# EAGLE design ScouseTom_New (EAGLE 7.2.0)

## Sheet 1 of 4
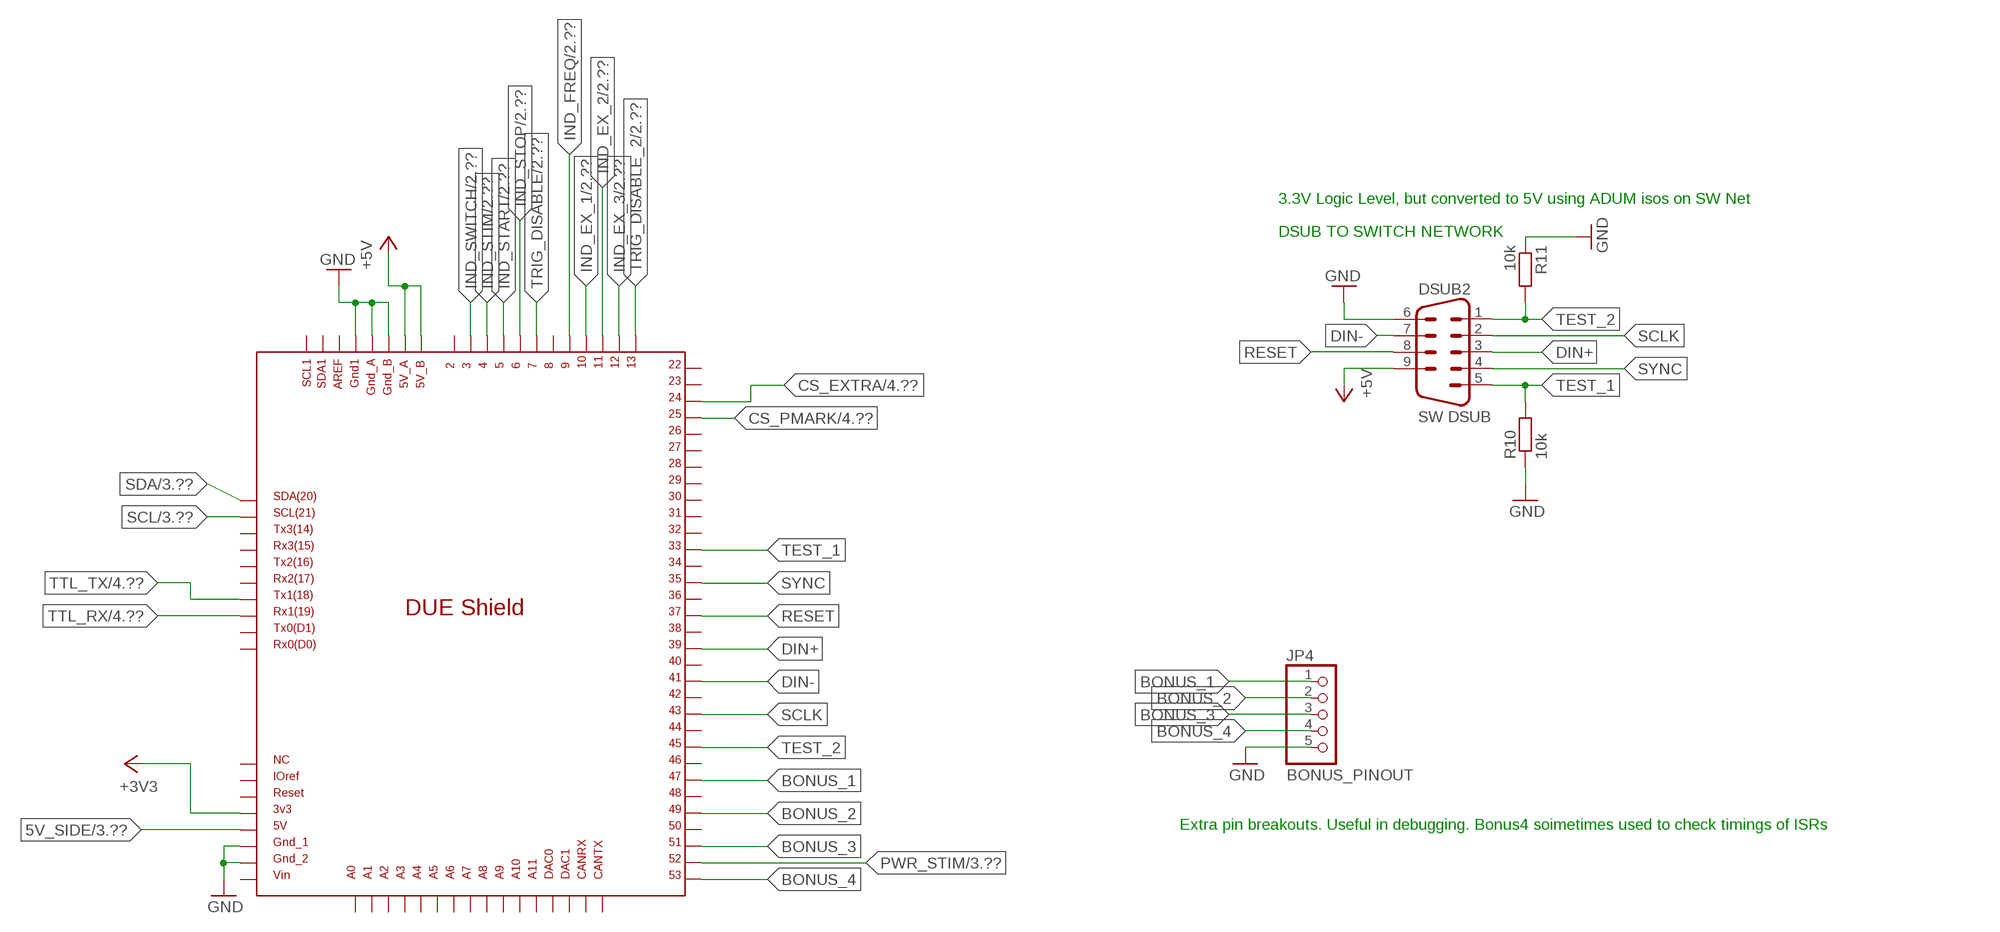
[diagram p0: schematic, sheet 1]

### Parts
ARD1  DUE(NOMID)  [DUE(NOMID)]
DSUB2  SW DSUB  DSUB9RA  [DSUB9]
JP4  BONUS_PINOUT  PINHD-1X5  [1X05]
R10  10k  R-EU_R0805  [R0805]
R11  10k  R-EU_R0805  [R0805]

### Nets
5V_SIDE: ARD1.5V ; also sheet 3
+3V3: ARD1.3V3 ; also sheet 3,4
+5V: ARD1.5V_A ARD1.5V_B DSUB2.9 ; also sheet 2
BONUS_1: ARD1.47 JP4.1
BONUS_2: ARD1.49 JP4.2
BONUS_3: ARD1.51 JP4.3
BONUS_4: ARD1.53 JP4.4
CS_EXTRA: ARD1.24 ; also sheet 4
CS_PMARK: ARD1.25 ; also sheet 4
DIN+: ARD1.39 DSUB2.3
DIN-: ARD1.41 DSUB2.7
GND: ARD1.GND1 ARD1.GND_1 ARD1.GND_2 ARD1.GND_A ARD1.GND_B DSUB2.6 JP4.5 R10.1 R11.1 ; also sheet 2,3,4
IND_EX_1: ARD1.10 ; also sheet 2
IND_EX_2: ARD1.11 ; also sheet 2
IND_EX_3: ARD1.12 ; also sheet 2
IND_FREQ: ARD1.9 ; also sheet 2
IND_START: ARD1.5 ; also sheet 2
IND_STIM: ARD1.4 ; also sheet 2,3
IND_STOP: ARD1.6 ; also sheet 2
IND_SWITCH: ARD1.3 ; also sheet 2
PWR_STIM: ARD1.52 ; also sheet 3
RESET: ARD1.37 DSUB2.8
SCL: ARD1.SCL ; also sheet 3
SCLK: ARD1.43 DSUB2.2
SDA: ARD1.SDA ; also sheet 3
SYNC: ARD1.35 DSUB2.4
TEST_1: ARD1.33 DSUB2.5 R10.2
TEST_2: ARD1.45 DSUB2.1 R11.2
TRIG_DISABLE: ARD1.7 ; also sheet 2
TRIG_DISABLE_2: ARD1.13 ; also sheet 2
TTL_RX: ARD1.RX1 ; also sheet 4
TTL_TX: ARD1.TX1 ; also sheet 4
Unconnected: ARD1.2 ARD1.8 ARD1.22 ARD1.23 ARD1.26 ARD1.27 ARD1.28 ARD1.29 ARD1.30 ARD1.31 ARD1.32 ARD1.34 ARD1.36 ARD1.38 ARD1.40 ARD1.42 ARD1.44 ARD1.46 ARD1.48 ARD1.50 ARD1.A0 ARD1.A1 ARD1.A2 ARD1.A3 ARD1.A4 ARD1.A5 ARD1.A6 ARD1.A7 ARD1.A8 ARD1.A9 ARD1.A10 ARD1.A11 ARD1.AREF ARD1.CANRX ARD1.CANTX ARD1.DAC0 ARD1.DAC1 ARD1.IOREF ARD1.NC ARD1.RESET ARD1.RX0 ARD1.RX2 ARD1.RX3 ARD1.SCL1 ARD1.SDA1 ARD1.TX0 ARD1.TX2 ARD1.TX3 ARD1.VIN

### Notes on the sheet
- 3.3V Logic Level, but converted to 5V using ADUM isos on SW Net
- DSUB TO SWITCH NETWORK
- Extra pin breakouts. Useful in debugging. Bonus4 soimetimes used to check timings of ISRs

## Sheet 2 of 4: Indicator_Isolation
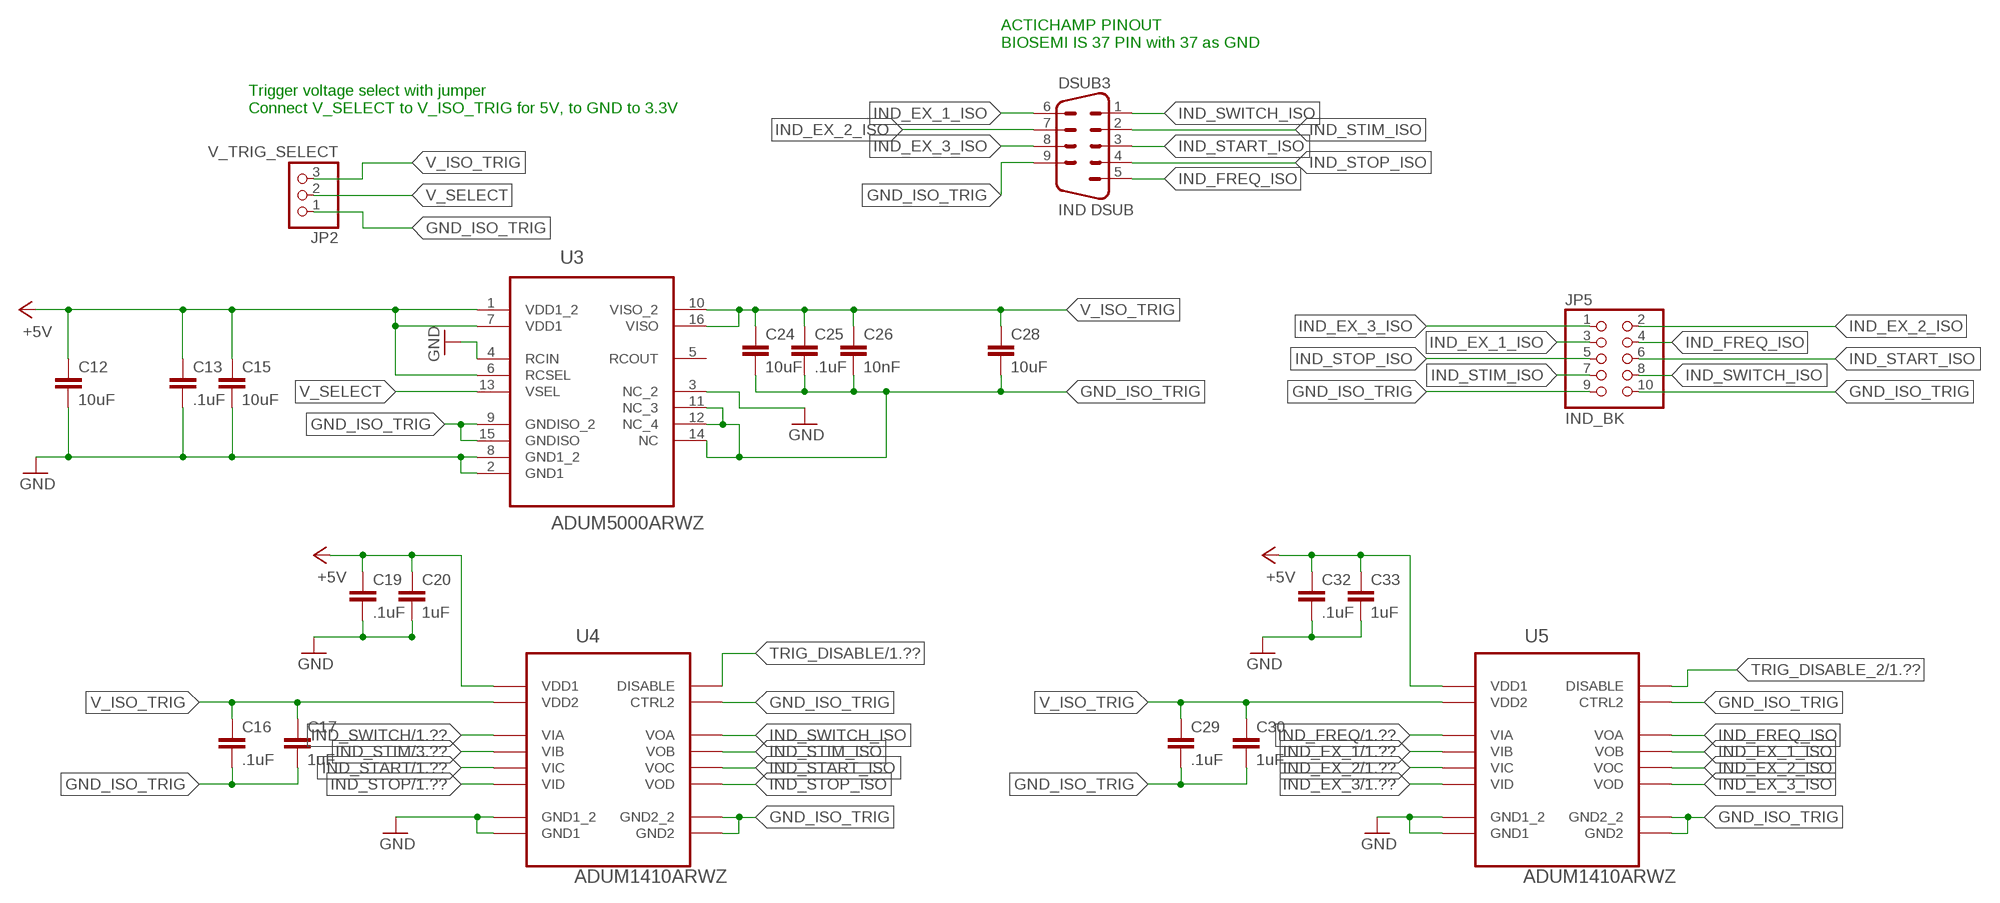
[diagram p1: schematic, sheet 2]

### Parts
C12  10uF  C-EUC0805  [C0805]
C13  .1uF  C-EUC0805  [C0805]
C15  10uF  C-EUC0805  [C0805]
C16  .1uF  C-EUC0805  [C0805]
C17  1uF  C-EUC0805  [C0805]
C19  .1uF  C-EUC0805  [C0805]
C20  1uF  C-EUC0805  [C0805]
C24  10uF  C-EUC0805  [C0805]
C25  .1uF  C-EUC0805  [C0805]
C26  10nF  C-EUC0805  [C0805]
C28  10uF  C-EUC0805  [C0805]
C29  .1uF  C-EUC0805  [C0805]
C30  1uF  C-EUC0805  [C0805]
C32  .1uF  C-EUC0805  [C0805]
C33  1uF  C-EUC0805  [C0805]
DSUB3  IND DSUB  DSUB9RA  [DSUB9]
JP2  V_TRIG_SELECT  PINHD-1X3  [1X03]
JP5  IND_BK  PINHD-2X5  [2X05]
U3  ADUM5000ARWZ  [SOIC127P1032X265-16N]
U4  ADUM1410ARWZ  [SOIC127P1032X265-16N]
U5  ADUM1410ARWZ  [SOIC127P1032X265-16N]

### Nets
+5V: C12.1 C13.1 C15.1 C19.1 C20.1 C32.1 C33.1 U3.1(VDD1_2) U3.6(RCSEL) U3.7(VDD1) U4.1(VDD1) U5.1(VDD1) ; also sheet 1
GND: C12.2 C13.2 C15.2 C19.2 C20.2 C32.2 C33.2 U3.2(GND1) U3.3(NC_2) U3.4(RCIN) U3.8(GND1_2) U4.2(GND1_2) U4.8(GND1) U5.2(GND1_2) U5.8(GND1) ; also sheet 1,3,4
GND_ISO_TRIG: C16.2 C17.2 C24.2 C25.2 C26.2 C28.2 C29.2 C30.2 DSUB3.9 JP2.1 JP5.9 JP5.10 U3.9(GNDISO_2) U3.11(NC_3) U3.12(NC_4) U3.14(NC) U3.15(GNDISO) U4.9(GND2_2) U4.10(CTRL2) U4.15(GND2) U5.9(GND2_2) U5.10(CTRL2) U5.15(GND2)
IND_EX_1: U5.4(VIB) ; also sheet 1
IND_EX_1_ISO: DSUB3.6 JP5.3 U5.13(VOB)
IND_EX_2: U5.5(VIC) ; also sheet 1
IND_EX_2_ISO: DSUB3.7 JP5.2 U5.12(VOC)
IND_EX_3: U5.6(VID) ; also sheet 1
IND_EX_3_ISO: DSUB3.8 JP5.1 U5.11(VOD)
IND_FREQ: U5.3(VIA) ; also sheet 1
IND_FREQ_ISO: DSUB3.5 JP5.4 U5.14(VOA)
IND_START: U4.5(VIC) ; also sheet 1
IND_START_ISO: DSUB3.3 JP5.6 U4.12(VOC)
IND_STIM: U4.4(VIB) ; also sheet 1,3
IND_STIM_ISO: DSUB3.2 JP5.7 U4.13(VOB)
IND_STOP: U4.6(VID) ; also sheet 1
IND_STOP_ISO: DSUB3.4 JP5.5 U4.11(VOD)
IND_SWITCH: U4.3(VIA) ; also sheet 1
IND_SWITCH_ISO: DSUB3.1 JP5.8 U4.14(VOA)
TRIG_DISABLE: U4.7(DISABLE) ; also sheet 1
TRIG_DISABLE_2: U5.7(DISABLE) ; also sheet 1
V_ISO_TRIG: C16.1 C17.1 C24.1 C25.1 C26.1 C28.1 C29.1 C30.1 JP2.3 U3.10(VISO_2) U3.16(VISO) U4.16(VDD2) U5.16(VDD2)
V_SELECT: JP2.2 U3.13(VSEL)
Unconnected: U3.5(RCOUT)

### Notes on the sheet
- ACTICHAMP PINOUT
  BIOSEMI IS 37 PIN with 37 as GND
- Trigger voltage select with jumper
  Connect V_SELECT to V_ISO_TRIG for 5V, to GND to 3.3V

## Sheet 3 of 4: Stimulator_PGA
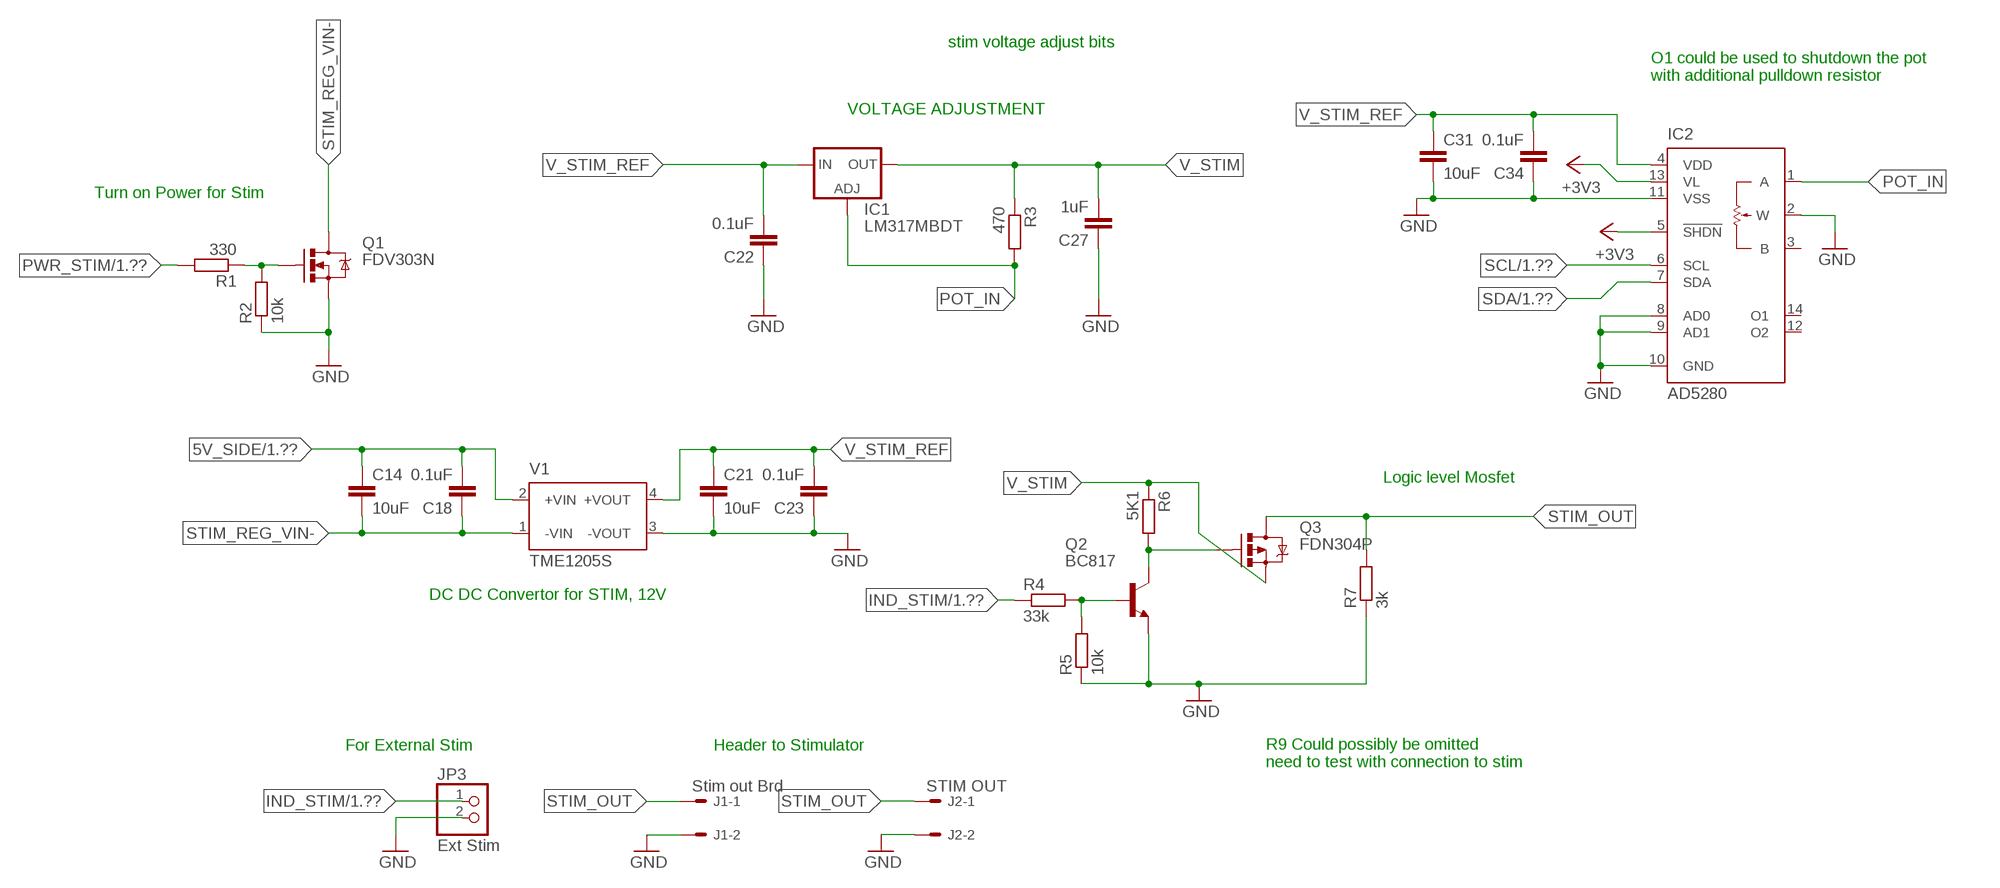
[diagram p2: schematic, sheet 3]

### Parts
C14  10uF  C-EUC0805  [C0805]
C18  0.1uF  C-EUC0805  [C0805]
C21  10uF  C-EUC0805  [C0805]
C22  0.1uF  C-EUC0805  [C0805]
C23  0.1uF  C-EUC0805  [C0805]
C27  1uF  C-EUC0805  [C0805]
C31  10uF  C-EUC0805  [C0805]
C34  0.1uF  C-EUC0805  [C0805]
IC1  LM317MBDT  [DPACK]
IC2  AD5280  [TSSOP14]
J1  Stim out Brd  22-27-2021-02  [6410-02]
J2  STIM OUT  22-05-7028-02  [7395-02]
JP3  Ext Stim  PINHD-1X2  [1X02]
Q1  FDV303N  MOSFET-NCHANNEL2N7002PW  [SOT323]
Q2  BC817  BC817-40SMD  [SOT23-BEC]
Q3  FDN304P  MOSFET-PCHANNEL  [SOT23-3]
R1  330  R-EU_R0805  [R0805]
R2  10k  R-EU_R0805  [R0805]
R3  470  R-EU_R0805  [R0805]
R4  33k  R-EU_R0805  [R0805]
R5  10k  R-EU_R0805  [R0805]
R6  5K1  R-EU_R0805  [R0805]
R7  3k  R-EU_R0805  [R0805]
V1  TME1205S  [TME]

### Nets
5V_SIDE: C14.1 C18.2 V1.2(+VIN) ; also sheet 1
+3V3: IC2.5(!SHDN) IC2.13(VL) ; also sheet 1,4
GND: C21.2 C22.1 C23.1 C27.1 C31.2 C34.1 IC2.2(W) IC2.8(AD0) IC2.9(AD1) IC2.10(GND) IC2.11(VSS) J1.2 J2.2 JP3.2 Q1.2(S) Q2.E R2.1 R5.1 R7.1 V1.3(-VOUT) ; also sheet 1,2,4
IND_STIM: JP3.1 R4.1 ; also sheet 1,2
N$1: Q2.B R4.2 R5.2
N$3: Q2.C Q3.1(G) R6.2
N$5: Q1.1(G) R1.1 R2.2
POT_IN: IC1.1(ADJ) IC2.1(A) R3.2
PWR_STIM: R1.2 ; also sheet 1
SCL: IC2.6(SCL) ; also sheet 1
SDA: IC2.7(SDA) ; also sheet 1
STIM_OUT: J1.1 J2.1 Q3.3(D) R7.2
STIM_REG_VIN-: C14.2 C18.1 Q1.3(D) V1.1(-VIN)
V_STIM: C27.2 IC1.4(OUT) Q3.2(S) R3.1 R6.1
V_STIM_REF: C21.1 C22.2 C23.2 C31.1 C34.2 IC1.3(IN) IC2.4(VDD) V1.4(+VOUT)
Unconnected: IC2.3(B) IC2.12(O2) IC2.14(O1)

### Notes on the sheet
- stim voltage adjust bits
- O1 could be used to shutdown the pot
  with additional pulldown resistor
- VOLTAGE ADJUSTMENT
- Turn on Power for Stim
- Logic level Mosfet
- DC DC Convertor for STIM, 12V
- For External Stim | Header to Stimulator
- R9 Could possibly be omitted
  need to test with connection to stim

## Sheet 4 of 4: Current_Source_Comm_Isolation
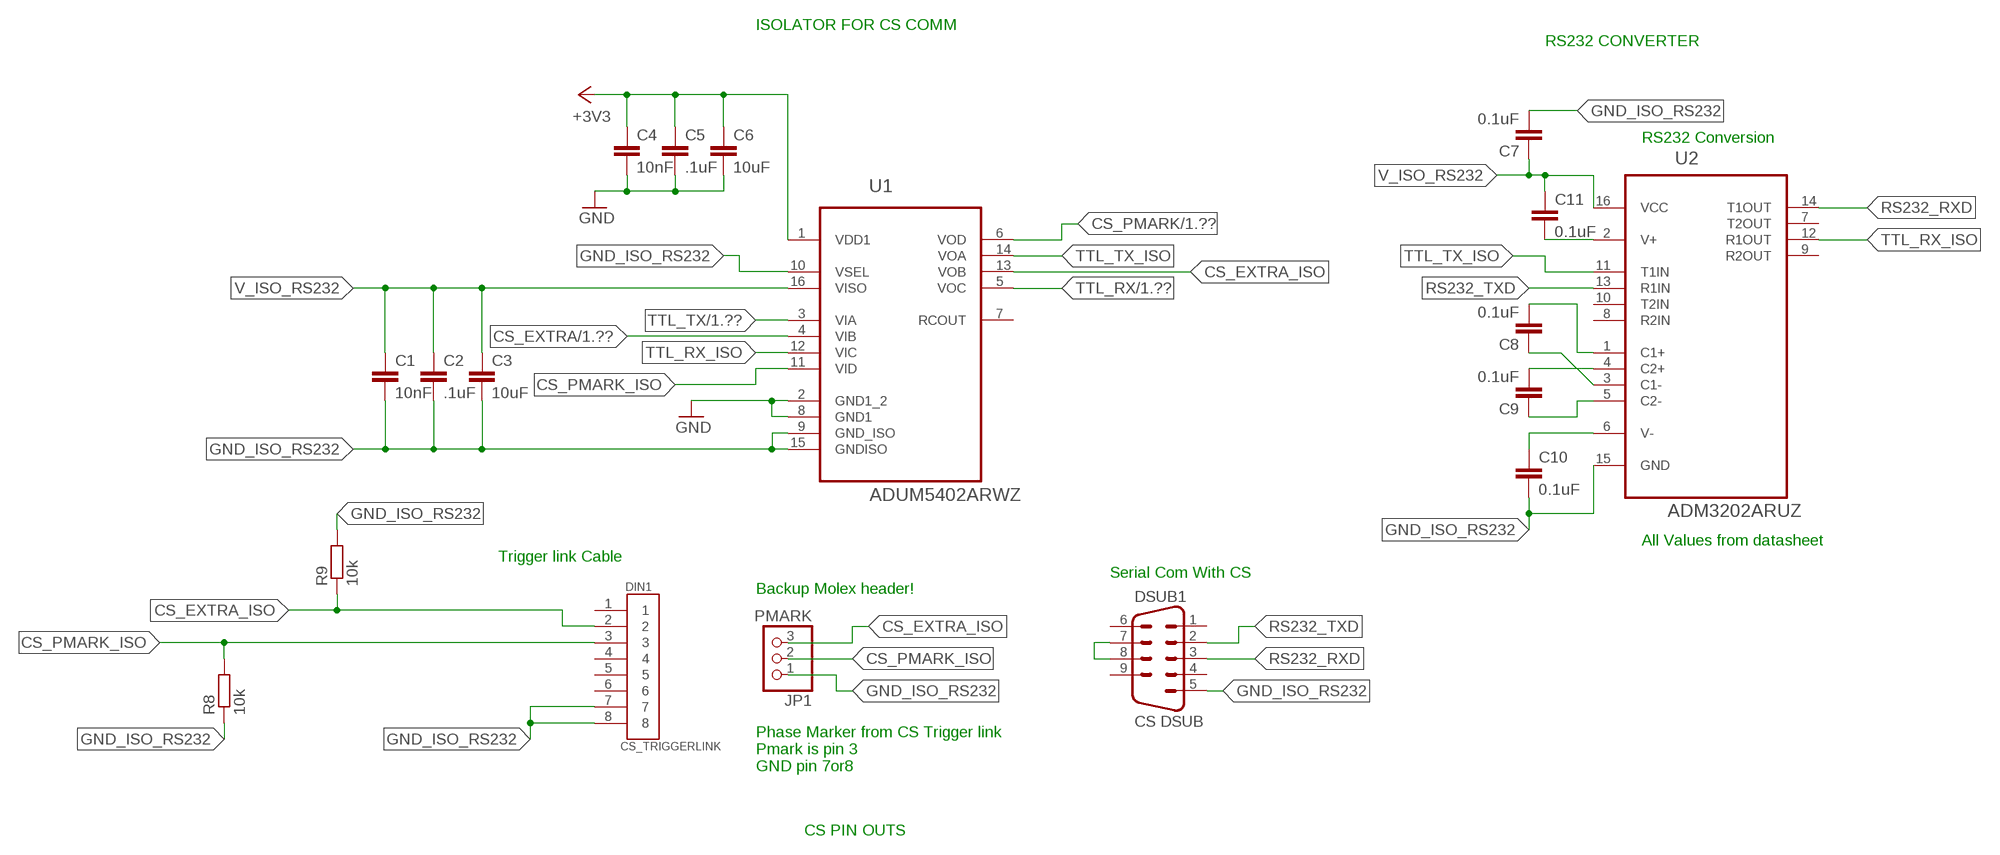
[diagram p3: schematic, sheet 4]

### Parts
C1  10nF  C-EUC0805  [C0805]
C2  .1uF  C-EUC0805  [C0805]
C3  10uF  C-EUC0805  [C0805]
C4  10nF  C-EUC0805  [C0805]
C5  .1uF  C-EUC0805  [C0805]
C6  10uF  C-EUC0805  [C0805]
C7  0.1uF  C-EUC0805  [C0805]
C8  0.1uF  C-EUC0805  [C0805]
C9  0.1uF  C-EUC0805  [C0805]
C10  0.1uF  C-EUC0805  [C0805]
C11  0.1uF  C-EUC0805  [C0805]
DIN1  CS_TRIGGERLINK  DIN8  [DIN8]
DSUB1  CS DSUB  DSUB9RA  [DSUB9]
JP1  PMARK  PINHD-1X3  [1X03]
R8  10k  R-EU_R0805  [R0805]
R9  10k  R-EU_R0805  [R0805]
U1  ADUM5402ARWZ  [SOIC127P1032X265-16N]
U2  ADM3202ARUZ  [SOP65P640X120-16N]

### Nets
+3V3: C4.1 C5.1 C6.1 U1.1(VDD1) ; also sheet 1,3
CS_EXTRA: U1.4(VIB) ; also sheet 1
CS_EXTRA_ISO: DIN1.2 JP1.3 R9.1 U1.13(VOB)
CS_PMARK: U1.6(VOD) ; also sheet 1
CS_PMARK_ISO: DIN1.3 JP1.2 R8.2 U1.11(VID)
GND: C4.2 C5.2 C6.2 U1.2(GND1_2) U1.8(GND1) ; also sheet 1,2,3
GND_ISO_RS232: C1.2 C2.2 C3.2 C7.2 C10.2 DIN1.7 DIN1.8 DSUB1.5 JP1.1 R8.1 R9.2 U1.9(GND_ISO) U1.10(VSEL) U1.15(GNDISO) U2.15(GND)
N$4: DSUB1.7 DSUB1.8
N$22: C8.2 U2.1(C1+)
N$23: C8.1 U2.3(C1-)
N$24: C9.2 U2.4(C2+)
N$25: C9.1 U2.5(C2-)
N$26: C11.2 U2.2(V+)
N$27: C10.1 U2.6(V-)
RS232_RXD: DSUB1.3 U2.14(T1OUT)
RS232_TXD: DSUB1.2 U2.13(R1IN)
TTL_RX: U1.5(VOC) ; also sheet 1
TTL_RX_ISO: U1.12(VIC) U2.12(R1OUT)
TTL_TX: U1.3(VIA) ; also sheet 1
TTL_TX_ISO: U1.14(VOA) U2.11(T1IN)
V_ISO_RS232: C1.1 C2.1 C3.1 C7.1 C11.1 U1.16(VISO) U2.16(VCC)
Unconnected: DIN1.1 DIN1.4 DIN1.5 DIN1.6 DSUB1.1 DSUB1.4 DSUB1.6 DSUB1.9 U1.7(RCOUT) U2.7(T2OUT) U2.8(R2IN) U2.9(R2OUT) U2.10(T2IN)

### Notes on the sheet
- ISOLATOR FOR CS COMM
- RS232 CONVERTER
- RS232 Conversion
- All Values from datasheet
- Trigger link Cable
- Serial Com With CS
- Backup Molex header!
- Phase Marker from CS Trigger link
  Pmark is pin 3
  GND pin 7or8
- CS PIN OUTS

## Library data of the parts
ARD1 = DUElib130425_JAMES:DUE(NOMID)
C1-C34 = resistor:C-EU: CAPACITOR, European symbol
DIN1 = mini din 8 james:DIN8
DSUB1-DSUB3 = DSUBJAMES:DSUB9RA
IC1 = v-reg:LM317?*: 500 mA Adjustable Output Positive Voltage Regulator Source: http://www.onsemi.co.jp .. LM317M-D.PDF
IC2 = analog-devices:AD5280: Single +15 V/±5 V, 256-Position, I2C-Compatible Digital Potentiometer Source: http://www.analog.com/static/imported-files/data_sheets/AD5280_5282.pdf; MF: ALTERA CORPORATION; MPN: AD5280BRUZ20; OC_FARNELL: 1464325; OC_NEWARK: 59K3840
J1 = con-molex:22-?-02: CONNECTOR wire to board 2.54 mm (.1 inch) pitch header; OC_FARNELL: unknown; OC_NEWARK: unknown
J2 = con-molex:22-?-02: CONNECTOR wire to board 2.54 mm (.1 inch) pitch header; OC_FARNELL: 9731601; OC_NEWARK: unknown
JP1 JP2 = pinhead:PINHD-1X3: PIN HEADER
JP3 = pinhead:PINHD-1X2: PIN HEADER
JP4 = pinhead:PINHD-1X5: PIN HEADER
JP5 = pinhead:PINHD-2X5: PIN HEADER
Q1 = SparkFun-DiscreteSemi:MOSFET-NCHANNEL: Common NMOSFET Parts MFG P/N Store ID Prod ID FDD8780 TRANS-09984 SI7820DN TRANS-11055 FDS6630A IC-08089 2N7002PW TRANS-11151 FQP30N06L COM-10213 TRANS-10060 BSS123LT1G TRANS-08345 BSS138 TRANS-00830 BS170 2N7000; PROD_ID: TRANS-11151
Q2 = transistor-npn:BC817*: NPN Transistor
Q3 = SparkFun-DiscreteSemi:MOSFET-PCHANNEL: Generic PMOSFET IRLML2244 - TRANS-11153 (SOT-23 -20V -4.3A) (1.Gate 2.Source 3.Drain) FQP27P06 - COM-10349 <http://www.sparkfun.com/products/10349> (TO-220 -60V -27A) (1.Gate 2.Source 3.Drain); PROD_ID: TRANS-08285
R1-R11 = resistor:R-EU_: RESISTOR, European symbol
U1 = Analog Devices_By_element14_Batch_1:ADUM5402ARWZ: Quad-Channel Isolators with Integrated DC-to-DC Converter; MPN: ADUM5402ARWZ; OC_FARNELL: 1838922; OC_NEWARK: 11N8824; PACKAGE: SOIC-16; SUPPLIER: Analog Devices
U2 = Analog Devices_By_element14_Batch_1:ADM3202ARUZ: Low Power, 3.3 V, RS-232 Line Drivers/Receivers; MPN: ADM3202ARUZ; OC_FARNELL: 9425586; OC_NEWARK: 59K2064; PACKAGE: TSSOP-16; SUPPLIER: Analog Devices
U3 = Analog Devices_By_element14_Batch_1:ADUM5000ARWZ: 2.5 kV, Isolated DC-to-DC Converter; MPN: ADUM5000ARWZ; OC_FARNELL: 1701256; OC_NEWARK: 19P8235; PACKAGE: SOIC-16; SUPPLIER: Analog Devices
U4 U5 = ADI-Phase-2:ADUM1410ARWZ: ISOLATOR, DGTL, 4CHAN; MPN: ADUM1410ARWZ; OC_FARNELL: 2067770; OC_NEWARK: 73T8174; PACKAGE: 16-Lead SOIC_W; SUPPLIER: Analog Devices
V1 = traco-electronic:TME?*: DC/DC Converter TME Series 1 Watt Source: www.tracopower.com .. tme.pdf; MPN: TME 1205S; OC_FARNELL: 1007542; OC_NEWARK: 51R5325

## Net classes
1 power: width 0.61 mm, drill 0.61 mm, clearance 0.254 mm
2 gnd: width 0.305 mm, drill 0.559 mm, clearance 0.254 mm
3 usbvcc: width 0.508 mm, drill 0.61 mm, clearance 0.254 mm
4 aref: width 0.406 mm, drill 0.61 mm, clearance 0.254 mm

## Board
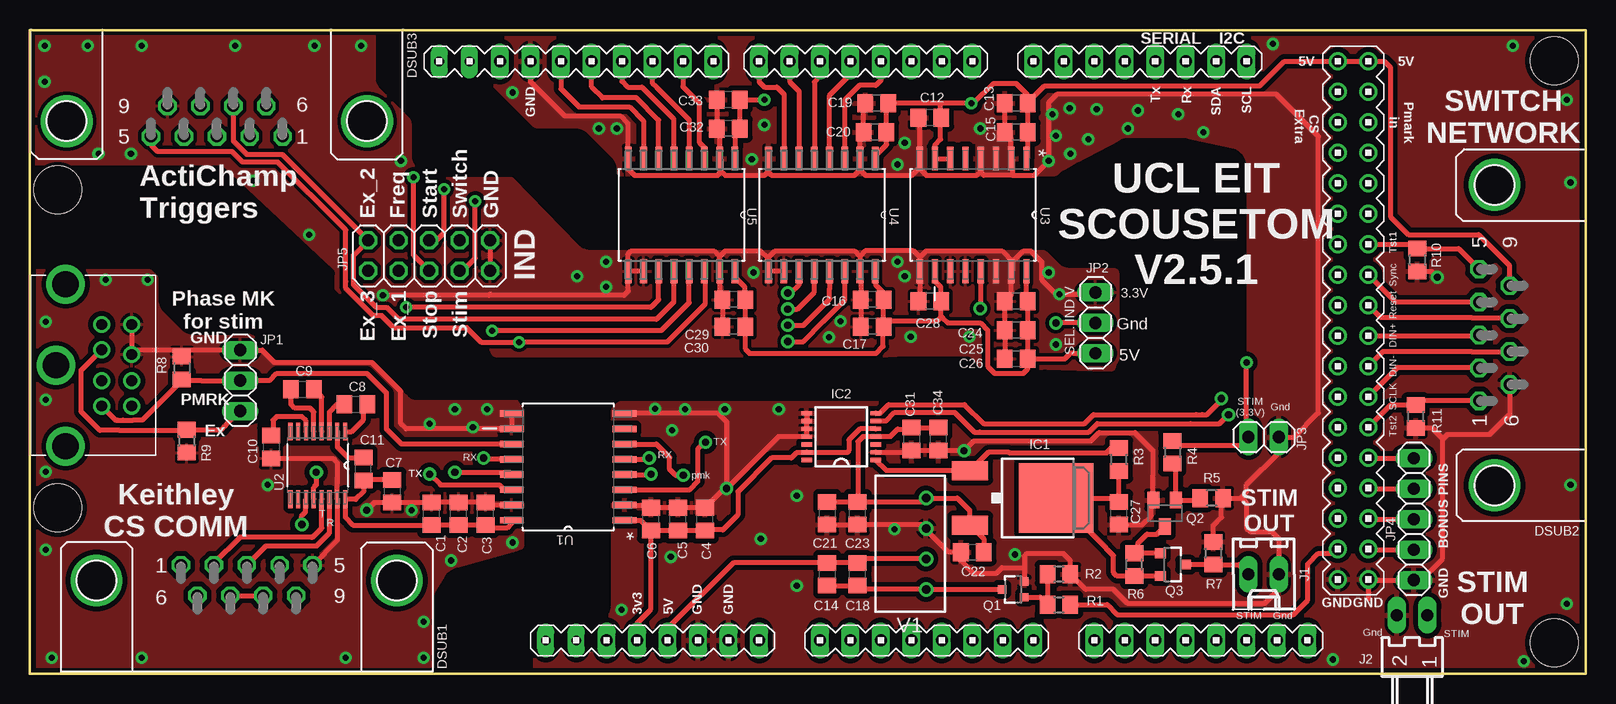
[diagram p4: board, top side]
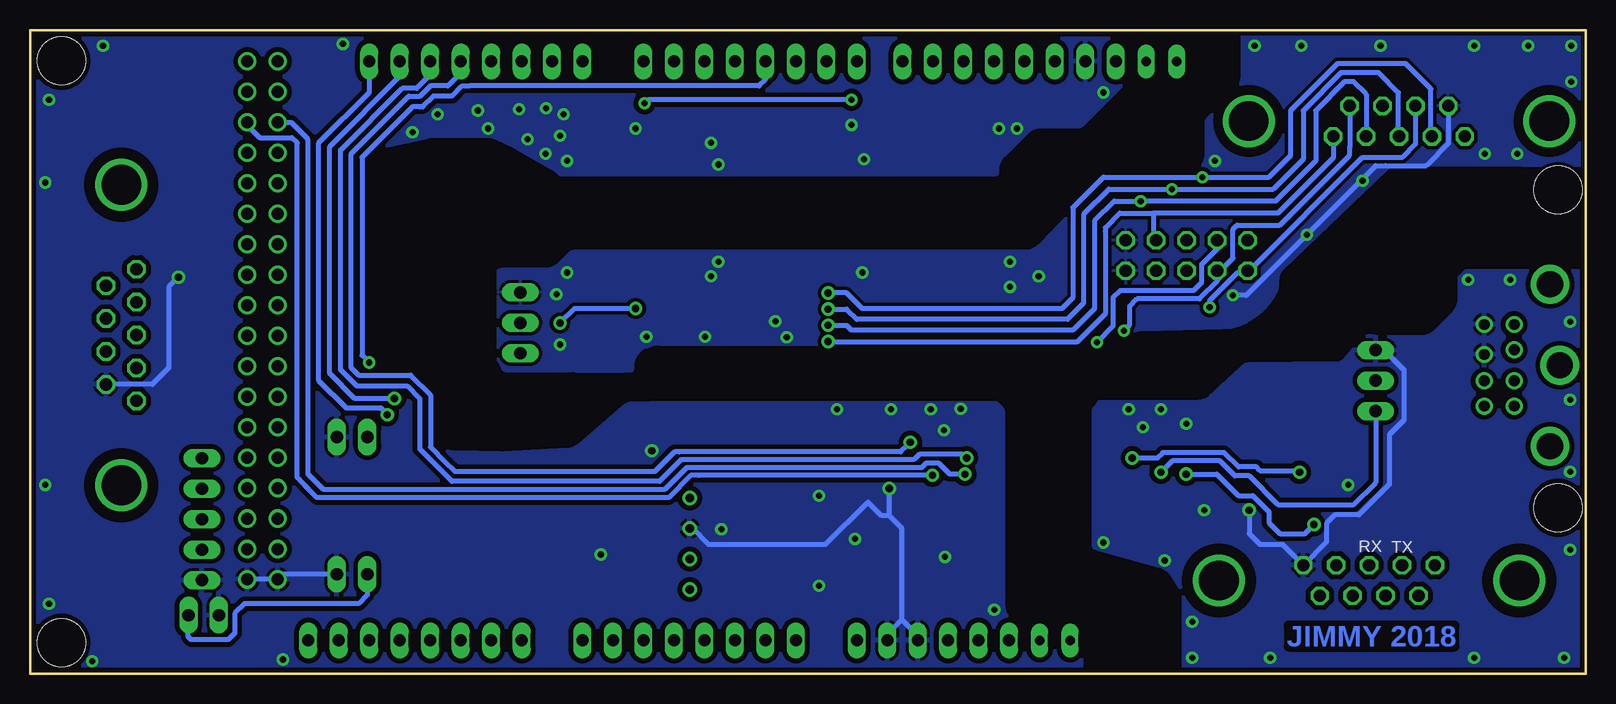
[diagram p5: board, bottom side, seen from below]

Size 129.69 x 53.67 mm. Coordinates in mm from the lower left corner, seen from the top.
Outline: 129.69,53.67 0,53.67 0,0 129.69,0 129.69,53.67
Copper layers (1*16): Top 0.035mm / dielectric 1.5mm / Bottom 0.035mm
Design rules "pcbtrain": minimum track width 0.2mm, minimum drill 0.4mm, track to track 0.2mm, track to pad 0.2mm, pad to pad 0.2mm, via to via 0.2mm, smd to smd 0mil, copper to edge 10mil, drill to drill 0.2mm, minimum pad ring 10mil, minimum via ring 10mil, stop-mask expansion 0.125mm, vias tented up to drill 0mil, thermal gap 10mil
Holes 4 mm at 127.06,51.11 127.06,2.61 2.31,13.86 2.31,40.36
tRestrict: area -5.2,-2.6 to 100.8,56.4
bRestrict: area -5.2,-2.6 to 100.8,56.4

### Footprints (pad centres in the part's own frame; a part is rotated, then mirrored left to right if it is on the bottom)
DUE(NOMID) = drill 1 long: 2 -5.08,25.4; 3 -7.62,25.4; 3V3 -27.94,-22.86; 4 -10.16,25.4; 5 -12.7,25.4; 5V -25.4,-22.86; 6 -15.24,25.4; 7 -17.78,25.4; 8 -21.59,25.4; 9 -24.13,25.4; 10 -26.67,25.4; 11 -29.21,25.4; 12 -31.75,25.4; 13 -34.29,25.4; A0 -12.7,-22.86; A1 -10.16,-22.86; A2 -7.62,-22.86; A3 -5.08,-22.86; A4 -2.54,-22.86; A5 0,-22.86; A6 2.54,-22.86; A7 5.08,-22.86; A8 10.16,-22.86; A9 12.7,-22.86; A10 15.24,-22.86; A11 17.78,-22.86; AREF -39.37,25.4; CANRX 25.4,-22.86; CANTX 27.94,-22.86; DAC0 20.32,-22.86; DAC1 22.86,-22.86; GND1 -36.83,25.4; GND_1 -22.86,-22.86; GND_2 -20.32,-22.86; RESET -30.48,-22.86; RX0 0,25.4; RX1 17.78,25.4; RX2 12.7,25.4; RX3 7.62,25.4; SCL 22.86,25.4; SDA 20.32,25.4; TX0 -2.54,25.4; TX1 15.24,25.4; TX2 10.16,25.4; TX3 5.08,25.4; VIN -17.78,-22.86 | drill 1: 5V_A 30.48,25.4; 5V_B 33.02,25.4; 22 30.48,22.86; 23 33.02,22.86; 24 30.48,20.32; 25 33.02,20.32; 26 30.48,17.78; 27 33.02,17.78; 28 30.48,15.24; 29 33.02,15.24; 30 30.48,12.7; 31 33.02,12.7; 32 30.48,10.16; 33 33.02,10.16; 34 30.48,7.62; 35 33.02,7.62; 36 30.48,5.08; 37 33.02,5.08; 38 30.48,2.54; 39 33.02,2.54; 40 30.48,0; 41 33.02,0; 42 30.48,-2.54; 43 33.02,-2.54; 44 30.48,-5.08; 45 33.02,-5.08; 46 30.48,-7.62; 47 33.02,-7.62; 48 30.48,-10.16; 49 33.02,-10.16; 50 30.48,-12.7; 51 33.02,-12.7; 52 30.48,-15.24; 53 33.02,-15.24; GND_A 30.48,-17.78; GND_B 33.02,-17.78 | drill 0.8 pad 1.422 long: IOREF -33.02,-22.86; NC -35.56,-22.86; SCL1 -44.45,25.4; SDA1 -41.91,25.4
C0805 = smd 1.3 x 1.5: 1 -0.95,0; 2 0.95,0
DIN8 = drill 0.9: 1 -1.3,-3.8; 2 1.3,-3.8; 3 -3.4,-3.8; 4 -1.3,-6.3; 5 3.4,-3.8; 6 -3.4,-6.3; 7 0.9,-6.3; 8 3.4,-6.3 | drill 2.2: P$1 0,0; P$2 -6.75,-0.8; P$3 6.75,-0.8
DSUB9 = drill 1.016 octagon: 1 -5.486,0; 2 -2.743,0; 3 0,0; 4 2.743,0; 5 5.486,0; 6 -4.115,-2.54; 7 -1.372,-2.54; 8 1.372,-2.54; 9 4.115,-2.54 | drill 3.302: 10 -12.522,-1.27; 11 12.522,-1.27
DPACK = smd 1.6 x 3: 1 -2.28,-4.8; 3 2.28,-4.8 | smd 5.8 x 6.2: 4 0,2.38
TSSOP14 = smd 0.9 x 0.35: 1 -2.875,1.95; 2 -2.875,1.3; 3 -2.875,0.65; 4 -2.875,0; 5 -2.875,-0.65; 6 -2.875,-1.3; 7 -2.875,-1.95; 8 2.875,-1.95; 9 2.875,-1.3; 10 2.875,-0.65; 11 2.875,0; 12 2.875,0.65; 13 2.875,1.3; 14 2.875,1.95
6410-02 = drill 1.016 long: 1 1.27,0; 2 -1.27,0
7395-02 = drill 1.016 long: 1 1.27,0; 2 -1.27,0
1X03 = drill 1.016 long: 1 -2.54,0; 2 0,0; 3 2.54,0
1X02 = drill 1.016 long: 1 -1.27,0; 2 1.27,0
1X05 = drill 1.016 long: 1 -5.08,0; 2 -2.54,0; 3 0,0; 4 2.54,0; 5 5.08,0
2X05 = drill 1.016 octagon: 1 -5.08,-1.27; 2 -5.08,1.27; 3 -2.54,-1.27; 4 -2.54,1.27; 5 0,-1.27; 6 0,1.27; 7 2.54,-1.27; 8 2.54,1.27; 9 5.08,-1.27; 10 5.08,1.27
SOT323 = smd 0.7 x 0.7: 1 -0.65,-0.925; 2 0.65,-0.925; 3 0,0.925
SOT23-BEC = smd 1 x 1.4: B -0.95,-1.1; C 0,1.1; E 0.95,-1.1
SOT23-3 = smd 0.8 x 0.9: 1 -0.95,-1; 2 0.95,-1; 3 0,1.1
R0805 = smd 1.3 x 1.5: 1 -0.95,0; 2 0.95,0
SOIC127P1032X265-16N = smd 1.981 x 0.533: 1 -4.699,4.445; 2 -4.699,3.175; 3 -4.699,1.905; 4 -4.699,0.635; 5 -4.699,-0.635; 6 -4.699,-1.905; 7 -4.699,-3.175; 8 -4.699,-4.445; 9 4.699,-4.445; 10 4.699,-3.175; 11 4.699,-1.905; 12 4.699,-0.635; 13 4.699,0.635; 14 4.699,1.905; 15 4.699,3.175; 16 4.699,4.445
SOP65P640X120-16N = smd 1.473 x 0.356: 1 -2.819,2.286; 2 -2.819,1.626; 3 -2.819,0.965; 4 -2.819,0.33; 5 -2.819,-0.33; 6 -2.819,-0.965; 7 -2.819,-1.626; 8 -2.819,-2.286; 9 2.819,-2.286; 10 2.819,-1.626; 11 2.819,-0.965; 12 2.819,-0.33; 13 2.819,0.33; 14 2.819,0.965; 15 2.819,1.626; 16 2.819,2.286
SOIC127P1032X265-16N' = smd 1.981 x 0.559: 1 -4.699,4.445; 2 -4.699,3.175; 3 -4.699,1.905; 4 -4.699,0.635; 5 -4.699,-0.635; 6 -4.699,-1.905; 7 -4.699,-3.175; 8 -4.699,-4.445; 9 4.699,-4.445; 10 4.699,-3.175; 11 4.699,-1.905; 12 4.699,-0.635; 13 4.699,0.635; 14 4.699,1.905; 15 4.699,3.175; 16 4.699,4.445
TME = drill 0.7 pad 1.1: 1 -3.81,0; 2 -1.27,0; 3 1.27,0; 4 3.81,0

### Placement (x,y rotation side)
ARD1  78.56,25.65 0 top
C1  33.46,13.36 90 top
C2  35.71,13.36 90 top
C3  37.96,13.36 90 top
C4  56.27,12.91 90 top
C5  54.02,12.91 90 top
C6  51.77,12.91 90 top
C7  30.2,15.23 270 top
C8  27.16,22.46 0 top
C9  22.71,23.74 0 top
C10  20.09,18.91 270 top
C11  27.8,17.09 90 top
C12  75.02,46.36 180 top
C13  82.22,47.56 180 top
C14  66.44,8.32 270 top
C15  82.22,45.16 180 top
C16  70.22,31.21 180 top
C17  70.22,28.96 180 top
C18  68.98,8.32 90 top
C19  70.59,47.56 180 top
C20  70.44,45.16 180 top
C21  66.44,13.39 270 top
C22  78.55,10.16 0 top
C23  68.98,13.39 90 top
C24  82.22,31.06 180 top
C25  82.22,28.65 180 top
C26  82.22,26.25 180 top
C27  90.78,13.39 90 top
C28  75.02,31.06 180 top
C29  58.66,31.21 180 top
C30  58.66,28.96 180 top
C31  73.48,19.58 270 top
C32  58.21,45.45 180 top
C33  58.21,47.86 180 top
C34  75.72,19.58 90 top
DIN1  2.17,25.72 90 top
DSUB1  18.06,9.07 0 top
DSUB2  120.81,28.25 90 top
DSUB3  15.57,44.8 180 top
IC1  83.16,14.66 270 top
IC2  67.62,19.78 180 top
J1  102.84,8.32 180 top
J2  115.22,4.91 0 top
JP1  17.52,24.46 270 top
JP2  88.81,29.25 270 top
JP3  102.84,19.75 0 top
JP4  115.36,12.91 270 top
JP5  33.27,34.87 0 top
Q1  81.96,7.05 90 top
Q2  94.59,13.39 180 top
Q3  95.22,9.12 270 top
R1  85.77,5.78 0 top
R2  85.77,8.32 180 top
R3  90.78,17.88 90 top
R4  95.22,18.47 270 top
R5  98.5,14.66 180 top
R6  92.05,9.12 90 top
R7  98.63,10.07 270 top
R8  12.66,25.5 270 top
R9  13.06,19.4 270 top
R10  115.66,34.5 90 top
R11  115.52,21.46 90 top
U1  44.87,17.25 180 top
U2  23.98,17.39 270 top
U3  78.61,38.25 270 top
U4  ADUM1410ARWZ  [SOIC127P1032X265-16N']  66.02,38.25 270 top
U5  ADUM1410ARWZ  [SOIC127P1032X265-16N']  54.31,38.25 270 top
V1  74.7,10.86 90 top

### Tracks (layer width: path | path; a pad name or v marks a point on that pad's centre or on a via)
5V_SIDE
  Top 0.406: V1.2 69.3,9.59 C18.2 C14.1 58.62,9.27 53.16,3.8 ARD1.5V
+3V3
  Top 0.406: C6.1 C5.1 C4.1 56.27,12 57.77,12 59.02,13.25 59.02,15.21 61.81,18 63.46,18 63.91,18.46 64.72,18.46 IC2.13 64.77,18.46 68.11,18.46 68.27,18.61 68.27,19.5 69.19,20.43 IC2.5 | C6.1 51.77,5.39 50.61,4.25 ARD1.3V3 | U1.1 50.91,12.81 C6.1
+5V  (via drill 0.51)
  Top 0.406: C13.1 C15.1 83.16,43.06 U3.1 | U4.1 70.56,43.06 70.56,43.25 71.42,44.11 71.42,45.12 C20.1 71.39,47.41 C19.1 75.92,47.56 | U3.6 U3.7 75.44,44.08 75.92,44.56 75.92,46.31 C12.1 75.92,46.41 75.92,47.56 | 75.92,47.56 v78.47,47.56 78.67,47.56 80.31,49.2 82.22,49.2 83.16,48.25 83.16,47.75 | U5.1 58.76,45.05 C32.1 C33.1 v61.21,47.86 | C13.1 83.16,47.61 | 83.16,47.61 83.16,47.75 | DSUB2.9 123.31,32.4 123.31,34.06 120.77,36.61 114.91,36.61 113.41,38.11 113.41,50.56 112.91,51.06 ARD1.5V_B ARD1.5V_A 104.56,51.06 102.52,49 84.56,49 83.16,47.61 | 83.16,47.75 83.27,47.75 | 83.16,47.61 C13.1
  Bottom 0.406: v61.21,47.86 78.17,47.86 v78.47,47.56
BONUS_1
  Top 0.406: ARD1.47 111.62,17.98 JP4.1
BONUS_2
  Top 0.406: ARD1.49 111.62,15.45 JP4.2
BONUS_3
  Top 0.406: ARD1.51 111.62,12.91 JP4.3
BONUS_4
  Top 0.406: ARD1.53 111.62,10.37 JP4.4
CS_EXTRA  (via drill 0.6)
  Top 0.406: U1.4 51.73,16.62 v51.77,16.66
  Bottom 0.406: ARD1.24 107.94,45.97 106.52,44.56 106.52,16.66 106.44,16.58 | v51.77,16.66 52.81,16.66 53.02,16.66 53.91,17.55 55.02,17.55 55.36,17.21 74.97,17.21 76.81,15.36 105.22,15.36 106.44,16.58 | 105.91,16.05 106.44,16.58
CS_EXTRA_ISO  (via drill 0.6)
  Top 0.406: v35.41,16.8 39.98,16.8 U1.13 | JP1.3 16.29,20.68 15.96,20.36 R9.1 13.02,20.31 7.46,20.31 5.81,20.31 4.26,21.86 4.26,25.32 DIN1.2
  Bottom 0.406: JP1.3 17.52,15.95 19.36,14.11 25.66,14.11 28.06,16.5 29.27,16.5 30.52,17.75 34.46,17.75 v35.41,16.8
CS_PMARK  (via drill 0.6)
  Top 0.406: U1.6 52.21,19.16 53.31,18.05 53.31,17.05 53.81,16.55 v54.46,16.55
  Bottom 0.406: ARD1.25 111.58,45.72 110.56,44.7 107.86,44.7 107.41,44.25 107.41,16.36 107.19,16.13 | 106.36,15.3 107.19,16.13 | v54.46,16.55 73.97,16.55 74.61,16.55 76.47,14.71 105.77,14.71 107.19,16.13
CS_PMARK_ISO
  Top 0.406: 7.29,21.15 7.76,21.15 | 7.76,21.15 8.61,21.15 9.36,21.15 12.66,24.46 | U1.11 30.96,19.16 29.71,20.4 29.71,23.4 28.06,25.06 20.56,25.06 19.96,24.46 JP1.2 14.26,24.46 12.66,24.46 | DIN1.3 7.14,21.15 7.76,21.15 | 12.66,24.46 R8.2
DIN+
  Top 0.406: ARD1.39 120.77,28.2 DSUB2.3
DIN-
  Top 0.406: DSUB2.7 123.34,26.86 120.16,26.86 112.77,26.86 ARD1.41
GND  (via drill 0.51, 0.6)
  Top 0.406: R7.1 98.63,12.37 99.31,13.05 99.31,14.53 R5.1 101,14.66 | 101,14.66 101.41,14.25 101.41,12.16 101.72,11.86 103.52,11.86 104.11,11.25 J1.2 104.11,7.05 102.91,5.86 91.52,5.86 90.31,7.05 87.98,7.05 R2.1 86.72,9.45 86.11,10.05 83.11,10.05 82.88,9.82 82.88,8.86 | 101,14.66 101,14.75 101.41,15.16 101.41,15.75 104.11,18.46 | C13.2 C15.2 81.79,44.63 U3.2 81.91,42.83 81.91,41.7 | C12.2 74.17,46.25 U3.8 74.17,42.16 | 74.17,42.16 74.17,42.1 74.72,41.56 78.92,41.56 79.22,41.86 | 79.22,41.86 79.22,42.92 U3.4 | IC2.8 64.81,21.66 64.81,21.15 IC2.9 IC2.10 IC2.11 62.39,19.78 v58.06,15.46 | U1.8 48.86,21.7 48.91,21.75 57.31,21.75 58.06,21 v58.06,15.46 | C21.2 C23.1 74.38,12.45 V1.3 74.7,12.03 76.52,10.21 77.56,10.21 C22.1 77.6,9.42 78.61,8.41 80.56,8.41 81.02,8.86 82.88,8.86 | C21.2 66.76,12.12 | U5.2 57.49,42.03 57.96,41.56 61.21,41.56 61.57,41.91 | 61.52,42.9 U4.8 61.57,41.91 | 69.19,42.03 U4.2 69.19,44.86 C20.2 69.48,47.41 C19.2 | 69.19,42.03 69.67,41.56 73.52,41.56 74.11,42.16 74.17,42.16 | 81.91,41.7 81.91,41.56 79.52,41.56 79.22,41.86 | 69.19,42.03 68.72,41.56 61.81,41.56 61.57,41.8 61.57,41.91 | U5.2 57.61,42.83 57.61,41.86 57.31,41.56 50.41,41.56 49.81,42.16 49.81,42.9 U5.8 49.81,43.01 49.81,45.91 49.21,46.5 44.56,46.5 41.73,49.34 ARD1.GND1 | C33.2 C32.2 57.49,45.23 U5.2 | 48.79,14.08 U1.2 51.54,14.08 C6.2 C5.2 C4.2 58.06,15.66 v58.06,15.46 | C21.2 | IC2.2 73.34,18.48 C31.2 C34.1 75.75,18.61 v77.86,18.61 78.67,19.4 88.41,19.4 89.11,20.11 92.11,20.11 93.61,18.61 93.61,16.61 93.61,14.47 Q2.E 93.47,14.32 93.47,13.21 92.7,12.45 C27.1 | 82.88,8.86 Q1.2 | 81.91,41.7 82.06,41.56 83.72,41.56 84.56,42.41
  Top 0.406: DSUB2.6 123.36,21.64 121.66,19.96 118.16,19.96 117.77,19.56 | 111.61,6.3 111.61,7.84 ARD1.GND_B 111.62,7.82 JP4.5 115.98,7.82 117.77,9.61 117.77,18 117.77,19.56 | 84.56,42.41 v84.91,42.75 | JP3.2 105.41,19.75 107.41,21.75 107.41,44.81 103.91,48.31 85.61,48.31 84.91,47.61 v84.91,42.75 | v84.91,42.75 84.56,42.41 | 117.77,19.56 117.77,19.61 116.86,20.5 R11.1 | R10.1 116.81,33.56 v117.31,33.06
  Bottom 0.406: ARD1.GND_B ARD1.GND_A 108.59,8.32 J1.2 | ARD1.GND_1 55.7,3.18 57.02,4.5 | ARD1.GND_2 58.23,3.29 57.02,4.5 | 78.02,18.46 v77.86,18.61 | 57.02,4.5 57.02,12.16 58.06,13.21 | 58.06,13.21 v58.06,15.46 | 58.06,13.21 58.71,13.21 59.84,14.33 63.36,10.8 73.17,10.8 74.48,12.12 V1.3 | v117.31,33.06 118.11,32.25 118.11,25.5 119.49,24.13 DSUB2.6
  other vias: 52.11,22.11 53.52,20.31 54.61,22.06 85.22,46.66 79.22,45.45 72.31,42.45 72.92,44.25 48.91,45.45 47.41,45.45 60.16,42.91 61.21,45.75 86.66,47.16 40.21,48.45 88.91,47.06 92.36,46.95 95.72,46.66 97.81,45.16 91.52,45.45 88.22,44.56 86.72,43.36 85.52,44.86 62.41,22.06 57.91,22.06 63.91,14.86 60.91,11.25 53.41,9.75 63.91,7.36 128.41,15.75 128.12,5.86 124.52,1.05 128.41,40.95 128.12,47.86 123.61,52.36 103.61,52.51 108.61,1.21 82.11,9.96 72.06,12.05 49.31,5.36
  pour Top (isolate 0.406, rank 6): 32.81,53.86 129.81,53.86 129.81,-0.14 41.31,-0.14 41.31,3.44 arc-45 41.61,4.15 42.02,4.56 arc-45 42.73,4.86 46.81,4.86 47.31,5.36 47.31,22.36 48.91,23.56 96.11,23.56 97.61,25.06 97.61,39.95 96.22,40.16 92.91,40.16 88.72,39.95 84.31,40.06 48.71,39.45 47.71,40.45 45.02,42.45 44.52,42.95 40.12,43.86 37.12,46.86 33.81,48.36 32.31,49.86 32.31,53.36
  pour Top (isolate 0.406, no thermals): 48.61,21.15 53.11,21.15 53.11,25.06 47.71,25.06 47.71,21.15
  pour Top (isolate 0.305, no thermals): 81.91,41.56 81.91,44.86 78.92,44.86 78.92,41.56
  pour Top (isolate 0.406, no thermals): 72.61,44.25 74.72,44.25 74.72,41.25 72.61,41.25
  pour Top (isolate 0.305, no thermals): 55.52,15.46 58.21,15.46 58.21,13.36 55.52,13.36
  pour Bottom (isolate 0.406): 39.91,-6.84 40.41,4.66 45.31,8.55 45.91,24.46 79.81,23.65 87.22,20.15 95.02,21.86 94.72,39.66 73.52,39.45 48.41,39.56 36.71,46.66 31.41,49.95 31.41,58.36 136.22,58.36 135.91,-7.04
GND_ISO_RS232  (via drill 0.51, 0.6)
  Top 0.406: U1.15 38.19,14.08 C3.2 C2.2 C1.2 33.44,14.28 C7.2 28.68,14.28 v28.06,13.66 | 25.61,15.91 U2.15 25.61,11.12 DSUB1.5 | 25.61,15.91 25.61,16.41 | U1.9 U1.10 31.34,20.43 30.91,20.86 30.91,23.56 28.52,25.96 20.41,25.96 19.38,27 JP1.1 8.84,27 DIN1.7 DIN1.8 | C10.2 25.26,17.96 25.52,17.71 25.61,17.61 25.61,15.91
  Bottom 0.406: JP1.1 16.8,27 15.16,25.36 15.16,21.15 16.36,19.96 16.36,15.8 18.91,13.25 20.91,13.25 21.61,12.55 21.61,11 DSUB1.5 25.29,10.8 27.16,10.8 28.06,11.71 v28.06,13.66
  other vias: 38.12,22.06 35.41,22.06 36.91,20.56 40.21,10.96 35.12,9.46 31.81,13.66 33.31,20.86 19.81,15.75 6.31,32.86 9.81,32.86 1.31,29.36 1.31,22.86 1.31,16.86 1.31,10.36 1.81,1.36 9.31,1.36 26.31,1.36 32.81,1.36 32.81,4.36
  pour Top (isolate 0.406): 34.52,-0.45 37.52,4.96 37.81,5.25 42.31,9.16 42.31,21.96 arc90 41.31,22.96 33.31,22.96 29.31,26.76 arc45 28.6,27.06 20.91,27.46 18.91,30.15 12.91,33.16 12.02,33.16 11.41,33.45 10.21,34.66 -1.49,34.66 -1.49,-0.74 -1.19,-0.45
  pour Top (isolate 0.406, no thermals): 41.12,20.25 41.12,24.46 33.62,24.46 33.62,20.25
  pour Bottom (isolate 0.406): -7.19,33.45 -7.49,36.45 10.91,35.36 27.82,26.36 arc25 31.24,24.94 41.52,24.56 44.02,22.36 43.41,9.36 37.71,4.66 36.91,-4.04 -2.38,-2.54 -6.88,33.16
GND_ISO_TRIG  (via drill 0.51)
  Top 0.406: C26.2 C25.2 C24.2 81.79,31.58 U3.15 81.91,33.68 81.91,34.36 | 74.17,34.71 U3.9 74.17,31.16 C28.2 | 74.17,34.71 74.72,35.25 81.02,35.25 81.91,34.36 | U5.9 49.87,35.01 50.11,35.25 57.02,35.25 57.49,34.78 | U5.10 U5.9 | U4.10 U4.9 61.52,33.61 61.52,34.71 | 74.17,34.71 73.62,35.25 69.61,35.25 69.19,34.83 | 57.49,34.78 57.96,35.25 60.91,35.25 61.46,34.71 61.52,34.71 | 61.52,34.71 61.57,34.71 62.11,35.25 68.72,35.25 69.14,34.83 69.19,34.83 | 69.19,34.83 U4.15 69.27,33.48 C16.2 C17.2 | 57.49,34.78 U5.15 57.49,31.43 C29.2 C30.2 | 81.91,34.36 82.81,35.25 83.41,35.25 84.31,34.36 84.31,32.86 85.52,31.65 v85.81,31.65 88.67,31.65 JP2.1 | 38.27,31.56 v29.41,31.56 | JP5.10 JP5.9 | 38.35,31.64 38.27,31.56 | 38.27,31.56 49.52,31.56 49.87,31.91 U5.9
  Bottom 0.406: DSUB3.9 11.46,44.21 13.31,42.36 16.71,42.36 17.52,42.36 27.02,32.86 28.31,31.56 v29.41,31.56
  other vias: 84.91,33.45 72.31,34.36 72.92,33.16 48.02,34.36 48.02,32.25 45.62,33.16 60.31,33.45 67.56,29.4 66.61,28.06 85.52,27.46 30.91,42.75 27.62,52.36 23.71,52.36 17.11,52.36 9.31,52.36 4.81,52.36 1.21,52.36 1.21,49.36 8.41,43.36 5.71,43.36 73.42,28.11 78.31,28.11 18.61,41.11 23.27,36.61
  pour Top (isolate 0.305): 24.31,54.76 30.62,55.06 30.62,51.16 34.41,46.61 35.71,45.7 38.21,44.31 40.81,42.75 47.12,36.75 90.66,36.16 arc-44 91.1,35.97 91.63,35.44 arc-45 91.81,34.99 92.52,26.72 arc-45 92.73,25.87 91,24.14 arc-45 89.55,24.36 82.63,24.36 arc-45 80.92,24.15 80.22,24.25 79.02,24.25 76.81,24.56 75.61,25.75 73.31,26.06 40.91,26.06 35.21,25.86 33.31,26.06 28.47,28.22 arc7 27.06,28.38 20.71,30.15 15.12,36.16 -2.69,38.56 -2.99,42.16 -2.99,54.45 -2.69,54.76
  pour Top (isolate 0.406, no thermals): 79.81,35.56 82.22,35.56 82.22,31.96 79.81,31.96
  pour Top (isolate 0.406, no thermals): 75.02,35.86 75.02,32.56 72.61,32.56 72.61,35.86
  pour Bottom (isolate 0.305): 0.01,53.86 30.52,53.66 30.41,49.16 38.62,44.06 44.12,40.95 49.52,37.95 93.81,38.06 93.61,23.65 86.02,23.86 78.11,25.25 36.15,26.26 arc-26 31.71,27.25 9.21,38.06 -0.19,38.36
IND_EX_1
  Top 0.406: ARD1.10 51.91,51.03 51.91,49.2 52.21,48.91 54.95,46.17 U5.4
IND_EX_1_ISO  (via drill 0.51)
  Top 0.406: v38.52,28.61 52.61,28.61 54.95,30.94 U5.13
  Bottom 0.406: DSUB3.6 19.69,43.91 19.69,43.23 25.52,37.41 29.06,37.41 29.12,37.36 29.41,37.06 29.41,34.66 30.47,33.6 JP5.3 30.73,32.73 32.21,31.25 37.41,31.25 38.02,30.65 38.02,29.11 v38.52,28.61
IND_EX_2
  Top 0.406: U5.5 53.68,46.24 51.77,48.16 51.02,48.91 49.81,48.91 49.34,49.38 ARD1.11
IND_EX_2_ISO
  Top 0.406: U5.12 53.68,31.02 52.21,29.56 30.71,29.56 29.71,30.56 28.87,30.56 27.02,32.41 26.96,32.45 26.96,33.56 26.96,34.91 27.02,34.95 JP5.2 21.03,43.31 18.06,43.31 16.95,44.42 DSUB3.7
IND_EX_3
  Top 0.406: 52.52,43.06 U5.6 52.41,46.16 50.56,48 47.71,48 46.81,48.91 ARD1.12
IND_EX_3_ISO  (via drill 0.51)
  Top 0.406: v31.37,30.56 51.77,30.56 52.41,31.2 U5.11
  Bottom 0.406: DSUB3.8 14.2,44.17 15.31,43.06 18.61,43.06 28.07,33.6 JP5.1 | JP5.1 28.21,33.58 | JP5.1 28.2,33.47 28.99,33.47 31.37,31.11 v31.37,30.56
IND_FREQ
  Top 0.406: U5.3 56.22,43.85 55.81,44.25 55.81,47.56 54.42,48.95 ARD1.9
IND_FREQ_ISO  (via drill 0.51)
  Top 0.406: 10.06,44.78 DSUB3.5 10.09,44.08 10.61,43.56 15.41,43.56 16.81,43.56 17.49,42.88 | U5.14 56.22,33.35 56.27,33.31 56.27,30.81 53.11,27.65 v40.77,27.65 37.62,27.65 36.41,28.86 30.31,28.86 29.31,29.86 28.62,29.86 26.52,31.96 26.37,32.11 26.31,32.16 26.31,32.7 26.31,37 25.94,37.38 20.66,42.66 17.71,42.66 17.49,42.88 | 17.49,42.88 17.31,43.06
  Bottom 0.406: JP5.4 30.73,35.44 32.02,34.16 32.02,32.66 32.71,31.96 38.81,31.96 39.41,31.36 39.41,29.11 39.41,29 v40.77,27.65
IND_START
  Top 0.406: U4.5 65.38,49.32 65.86,49.81 ARD1.5
IND_START_ISO  (via drill 0.51, 0.6)
  Top 0.406: U4.12 65.38,32.52 65.38,31.82 64.52,30.96 63.96,30.4 v63.16,30.4 | JP5.6 33.9,36.14 34.52,36.75 v34.52,40.41
  Bottom 0.406: DSUB3.3 15.62,44.84 15.62,48.45 17.27,50.11 20.41,50.11 23.56,46.95 23.56,42.91 26.06,40.41 v34.52,40.41 39.77,40.41 41.87,38.31 41.87,30.9 43.21,29.56 60.77,29.56 61.61,30.4 v63.16,30.4
IND_STIM  (via drill 0.51)
  Top 0.406: R4.1 95.59,19.06 101.41,19.06 101.58,19.21 JP3.1 101.41,19.9 v101.41,25.96 | U4.4 66.65,48.24 68.39,49.98 ARD1.4
  Bottom 0.406: ARD1.4 68.39,49.53 68.92,49 93.06,49 93.66,49 94.52,48.16 96.06,48.16 96.97,47.25 97.22,47.25 97.81,47.25 102.02,43.06 102.02,26.56 v101.41,25.96
IND_STIM_ISO  (via drill 0.51, 0.6)
  Top 0.406: U4.13 66.65,32.14 66.65,31.24 65.27,29.86 64.47,29.06 v63.16,29.06 | JP5.7 36.06,33.6 37.12,34.66 v37.12,39.41
  Bottom 0.406: DSUB3.2 18.31,48.31 19.36,49.36 20.11,49.36 22.52,46.95 22.52,42.75 25.87,39.41 v37.12,39.41 39.31,39.41 40.96,37.75 40.96,37.66 40.96,37.16 40.96,30.46 42.77,28.65 61.21,28.65 61.61,29.06 v63.16,29.06
IND_STOP
  Top 0.406: U4.6 64.11,48.56 63.31,49.36 ARD1.6
IND_STOP_ISO  (via drill 0.51, 0.6)
  Top 0.406: U4.11 64.11,32.45 63.41,31.75 v63.16,31.75 | JP5.5 31.96,34.91 v31.96,41.41
  Bottom 0.406: DSUB3.4 12.91,44.88 12.91,48.75 15.01,50.86 20.71,50.86 24.62,46.95 24.62,43.2 26.41,41.41 v31.96,41.41 40.21,41.41 42.77,38.86 42.77,31.36 43.66,30.46 60.31,30.46 61.61,31.75 62.66,31.75 v63.16,31.75
IND_SWITCH
  Top 0.406: U4.3 67.92,47.85 69.12,49.06 70.52,49.06 70.94,49.47 ARD1.3
IND_SWITCH_ISO  (via drill 0.6)
  Top 0.406: U4.14 67.92,32.66 67.92,31.16 67.36,30.61 66.17,29.4 64.47,27.71 v63.16,27.71
  Bottom 0.406: JP5.8 36.02,36.34 36.02,38.41 | 36.02,38.41 25.66,38.41 21.06,43.01 DSUB3.1 | 36.02,38.41 38.87,38.41 40.06,37.2 40.06,36.86 40.06,30 40.71,29.36 | 40.71,29.36 42.31,27.75 | v63.16,27.71 42.37,27.71 40.71,29.36
N$1
  Top 0.406: R4.2 95.54,17.21 Q2.B 97.38,14.5 R5.2
N$3
  Top 0.406: Q3.1 R6.2 92.05,10.39 92.37,10.39 92.37,10.91 93.11,11.66 93.95,11.66 Q2.C 94.59,11.81
N$4
  Top 0.406: DSUB1.7 DSUB1.8
N$5
  Top 0.406: Q1.1 84.2,6.39 R1.1 R2.2
N$22
  Top 0.406: U2.1 26.8,20.2 27.8,21.2 27.8,22.15 C8.2
N$23
  Top 0.406: C8.1 25.57,22.46 24.94,21.83 24.94,20.22 U2.3
N$24
  Top 0.406: U2.4 24.31,23.08 C9.2
N$25
  Top 0.406: U2.5 23.66,21.84 23.35,22.15 22.08,22.15 21.76,22.46 C9.1
N$26
  Top 0.406: U2.2 25.61,18.93 25.89,18.65 26.51,18.04 C11.2
N$27
  Top 0.406: U2.6 23.02,21.1 22.66,21.46 20.56,21.46 20.27,21.15 20.27,20.04 C10.1
POT_IN
  Top 0.406: R3.2 90.16,18.82 | 90.16,18.82 90.08,18.82 89.72,18.46 | IC2.1 71.38,16.95 IC1.1 79.89,18.47 81.59,18.47 81.61,18.46 89.8,18.46 90.16,18.82
PWR_STIM
  Top 0.406: R1.2 89.8,5.78 90.61,4.96 105.31,4.96 106.52,6.16 106.52,9.16 107.41,10.05 108.67,10.05 ARD1.52
RESET
  Top 0.406: DSUB2.8 123.27,29.71 120.16,29.71 112.61,29.71 ARD1.37
RS232_RXD
  Top 0.406: U2.14 24.95,11.74 23.87,10.66 19.66,10.66 DSUB1.3
RS232_TXD
  Top 0.406: U2.13 24.31,12.16 23.56,11.41 23.41,11.41 17.51,11.41 15.32,9.21 DSUB1.2
SCL  (via drill 0.6)
  Top 0.406: v99.91,21.61 99.16,20.86 96.77,20.86 88.97,20.86 88.27,20.15 79.17,20.15 | 78.72,20.15 79.17,20.15 | IC2.6 71.34,21.08 72.06,21.81 77.06,21.81 78.72,20.15 | 78.72,20.15 79.17,20.15
  Bottom 0.406: ARD1.SCL 101.41,48.45 105.61,44.25 105.61,24.46 103.31,22.15 100.41,22.15 100.22,21.96 100.22,21.9 v99.91,21.61
SCLK
  Top 0.406: DSUB2.2 113.96,25.5 ARD1.43
SDA  (via drill 0.6)
  Top 0.406: 97.22,21.61 97.72,21.61 | 97.72,21.61 98.11,21.61 99.31,22.81 v99.31,22.96 | IC2.7 70.84,21.73 71.56,22.46 77.92,22.46 79.52,20.86 87.91,20.86 88.66,21.61 97.72,21.61
  Bottom 0.406: v99.31,22.96 102.61,22.96 104.72,25.06 104.72,43.95 98.88,49.8 ARD1.SDA
STIM_OUT
  Top 0.406: J1.1 100.77,9.12 R7.2 Q3.3
  Bottom 0.406: J1.1 101.58,6.59 102.31,5.86 108.27,5.86 110.91,5.86 111.81,5.86 112.61,5.05 112.61,3.55 112.61,3.41 113.16,2.86 116.27,2.86 116.31,2.91 116.52,3.11 116.52,4.88 J2.1
STIM_REG_VIN-
  Top 0.406: Q1.3 V1.1 69.3,7.05 C18.1 C14.2
SYNC
  Top 0.406: DSUB2.4 113.86,30.99 ARD1.35
TEST_1
  Top 0.406: ARD1.33 115.3,35.81 R10.2 119.09,35.45 DSUB2.5
TEST_2
  Top 0.406: ARD1.45 113.41,22.4 R11.2 115.87,22.76 DSUB2.1
TRIG_DISABLE
  Top 0.406: ARD1.7 60.77,49.34 61.21,48.91 62.27,48.91 62.86,48.31 62.86,42.98 U4.7
TRIG_DISABLE_2
  Top 0.406: ARD1.13 44.27,48.75 45.77,47.25 49.96,47.25 51.16,46.06 51.16,42.98 U5.7
TTL_RX  (via drill 0.6)
  Top 0.406: U1.5 51.5,17.89 v51.61,18
  Bottom 0.406: v51.61,18 51.91,18.3 55.56,18.3 56.02,17.86 75.42,17.86 77.22,16.05 94.52,16.05 95.27,16.8 97.22,18.75 97.22,22.96 98.27,24 102.47,24 103.81,25.36 103.81,43.66 98.66,48.81 97.47,48.81 96.33,49.94 ARD1.RX1
TTL_RX_ISO  (via drill 0.6)
  Top 0.406: v23.87,16.8 23.87,15.75 23.66,15.55 U2.12 | U1.12 37.93,17.89 v37.81,18
  Bottom 0.406: v23.87,16.8 24.02,16.96 27.16,16.96 27.46,17.25 28.96,17.25 30.16,18.46 35.27,18.46 35.71,18 v37.81,18
TTL_TX  (via drill 0.6)
  Top 0.406: U1.3 54.96,15.35 55.66,16.05 55.66,18.75 56.21,19.31 v56.31,19.31
  Bottom 0.406: 95.11,17.71 96.31,18.9 96.31,23.25 97.97,24.9 102.31,24.9 102.91,25.5 102.91,43.36 98.11,48.16 97.22,48.16 97.16,48.16 96.31,49 94.86,49 94.81,49.06 93.8,50.08 ARD1.TX1 | 95.11,17.71 94.97,17.55 | v56.31,19.31 56.56,19.06 57.11,18.5 75.56,18.5 75.97,18.5 77.61,16.86 94.27,16.86 95.11,17.71
TTL_TX_ISO  (via drill 0.6)
  Top 0.406: U1.14 39.52,15.35 39.12,15.75 34.21,15.75 v33.31,16.66 | v22.66,12.46 22.66,13.21 22.96,13.5 22.96,14.51 U2.11
  Bottom 0.406: v33.31,16.66 30.77,16.66 28.96,14.86 27.77,14.86 26.41,13.5 26.41,12.61 25.52,11.71 23.41,11.71 v22.66,12.46
V_ISO_RS232
  Top 0.406: U1.16 40.17,12.56 39.77,12.16 38.21,12.16 C3.1 C2.1 C1.1 26.91,12.41 26.27,13.05 U2.16 27.16,14.55 27.8,15.18 C11.1 27.84,16.18 C7.1
V_ISO_TRIG
  Top 0.406: C26.1 C25.1 C24.1 83.06,31.16 U3.16 | U3.10 75.44,32.73 75.92,32.25 75.92,31.11 C28.1 75.92,31 75.92,29.71 | C26.1 83.16,25.4 82.81,25.06 80.41,25.06 79.81,25.65 79.81,28.65 79.22,29.25 76.52,29.25 76.06,29.71 75.92,29.71 | JP2.3 87.02,26.71 86.72,26.71 86.25,26.25 C26.1 | U5.16 58.76,33.06 59.56,32.25 59.56,31.25 C29.1 C30.1 59.61,27.11 60.02,26.71 70.52,26.71 71.11,27.31 71.11,28.9 C17.1 | C17.1 C16.1 71.17,31.75 70.52,32.41 70.52,33.5 U4.16 | 75.92,29.71 75.61,29.4 71.61,29.4 C17.1
V_SELECT  (via drill 0.6)
  Top 0.406: JP2.2 v85.52,29.25 | v79.22,30.46 79.25,30.49 U3.13
  Bottom 0.406: v79.22,30.46 84.31,30.46 v85.52,29.25
V_STIM
  Top 0.406: Q3.2 R6.1 90.61,8.16 90.31,8.46 90.31,9.86 89.72,10.46 89.72,10.49 88.31,11.89 87.38,12.82 IC1.4 90.46,14.66 C27.2 R3.1
V_STIM_REF
  Top 0.406: C21.1 C23.2 | C23.2 74.38,14.34 V1.4 77.31,14.66 78.31,13.66 78.31,12.43 IC1.3 78.39,12.39 79.52,11.25 79.52,10.18 C22.2 | C34.2 C31.1 73.36,20.4 72.31,20.4 71.69,19.78 IC2.4 69.44,19.78 69.02,19.36 69.02,14.38 C23.2

### Text on the board
Bottom: JIMMY 2018
tPlace: SERIAL | I2C | 5V | 5V | GND | Tx | Rx | SDA | SCL | Pmark / in | SWITCH / NETWORK | CS / Extra | ActiChamp / Triggers | Ex_2 | Freq | Start | Switch | GND | UCL EIT / SCOUSETOM / V2.5.1 | Tst1 | Tst1 | IND | Sync | Ex_3 | Ex_1 | Stop | Stim | 3.3V | Phase MK / for stim | Reset | SEL. IND V | Gnd | GND | DIN+ | 5V | DIN- | PMRK | SCLK | STIM / (3.3V) | Gnd | Ex | Tst2 | TX | RX | RX | BONUS PINS | TX | TX | pmk | Keithley / CS COMM | T | STIM / OUT | R | GND | GND | GND | STIM / OUT | 3v3 | 5V | GND | GND | STIM | Gnd | Gnd | STIM
bPlace: TX | RX